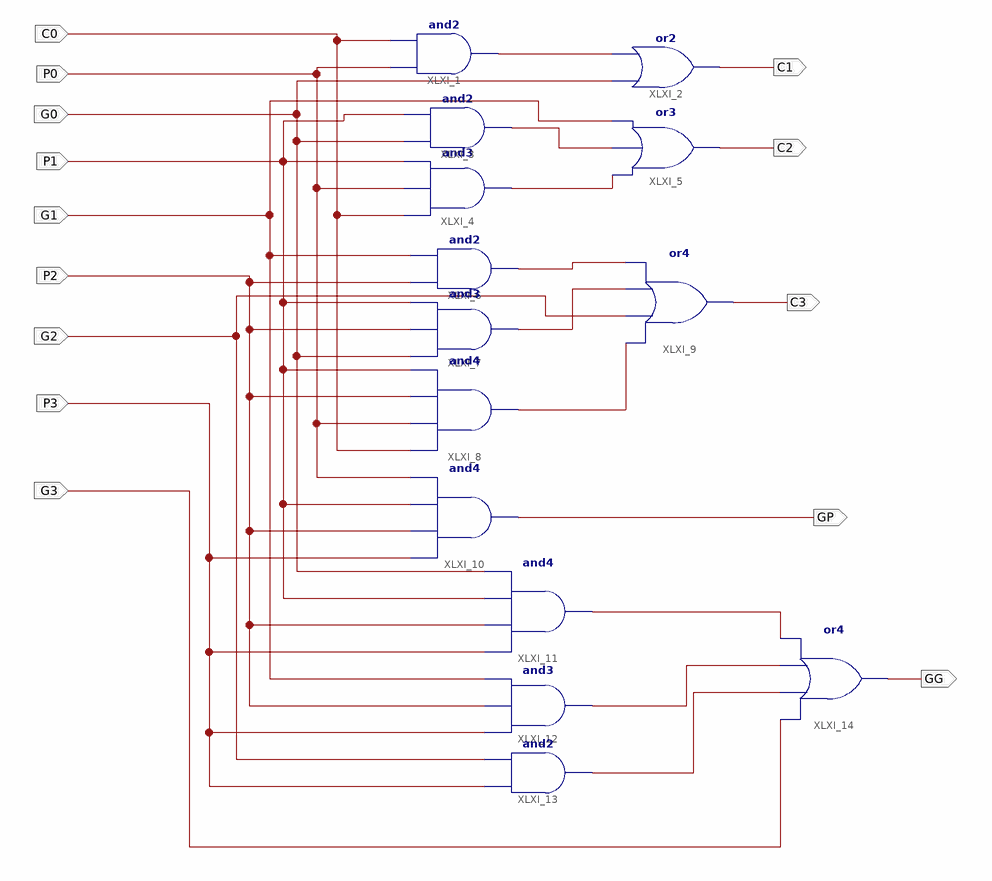
[diagram p0: schematic sheet 1]
// Xilinx ISE schematic CLA.sch (spartan3) as structural Verilog: 14 symbols, 14 ports
module CLA (
  input  G1,
  input  P2,
  input  G2,
  input  P3,
  input  C0,
  input  P1,
  input  P0,
  input  G0,
  input  G3,
  output C1,
  output C2,
  output C3,
  output GP,
  output GG
);

  wire XLXN_22, XLXN_25, XLXN_26, XLXN_30, XLXN_31, XLXN_33, XLXN_50, XLXN_51, XLXN_52;

  and XLXI_1 (XLXN_22, P0, C0);
  or XLXI_2 (C1, G0, XLXN_22);
  and XLXI_4 (XLXN_26, C0, P0, P1);
  and XLXI_3 (XLXN_25, G0, P1);
  or XLXI_5 (C2, XLXN_26, XLXN_25, G1);
  and XLXI_6 (XLXN_33, P2, G1);
  and XLXI_7 (XLXN_31, G0, P2, P1);
  and XLXI_8 (XLXN_30, C0, P0, P2, P1);
  or XLXI_9 (C3, XLXN_30, G2, XLXN_31, XLXN_33);
  and XLXI_10 (GP, P3, P2, P1, P0);
  and XLXI_11 (XLXN_50, P3, P2, P1, G0);
  and XLXI_12 (XLXN_51, P3, P2, G1);
  and XLXI_13 (XLXN_52, P3, G2);
  or XLXI_14 (GG, G3, XLXN_52, XLXN_51, XLXN_50);
endmodule
